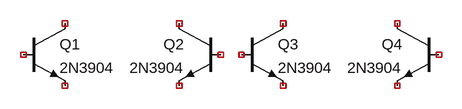
[diagram p0: schematic Q1.asc]
Q1.asc, the LTspice schematic file:
Version 4
SHEET 1 880 680
SYMBOL npn 64 32 R0
SYMATTR InstName Q1
SYMATTR Value 2N3904
SYMBOL npn 368 32 M0
SYMATTR InstName Q2
SYMATTR Value 2N3904
SYMBOL npn 400 32 R0
SYMATTR InstName Q3
SYMATTR Value 2N3904
SYMBOL npn 704 32 M0
SYMATTR InstName Q4
SYMATTR Value 2N3904

The netlist it stands for:
* Q1.asc
Q1 NC_01 NC_02 NC_03 0 2N3904
Q2 NC_04 NC_05 NC_06 0 2N3904
Q3 NC_07 NC_08 NC_09 0 2N3904
Q4 NC_10 NC_11 NC_12 0 2N3904
.model NPN NPN
.model PNP PNP
.lib standard.bjt
.backanno
.end